# EAGLE design CIA-11:19:21 (EAGLE 9.7.0)
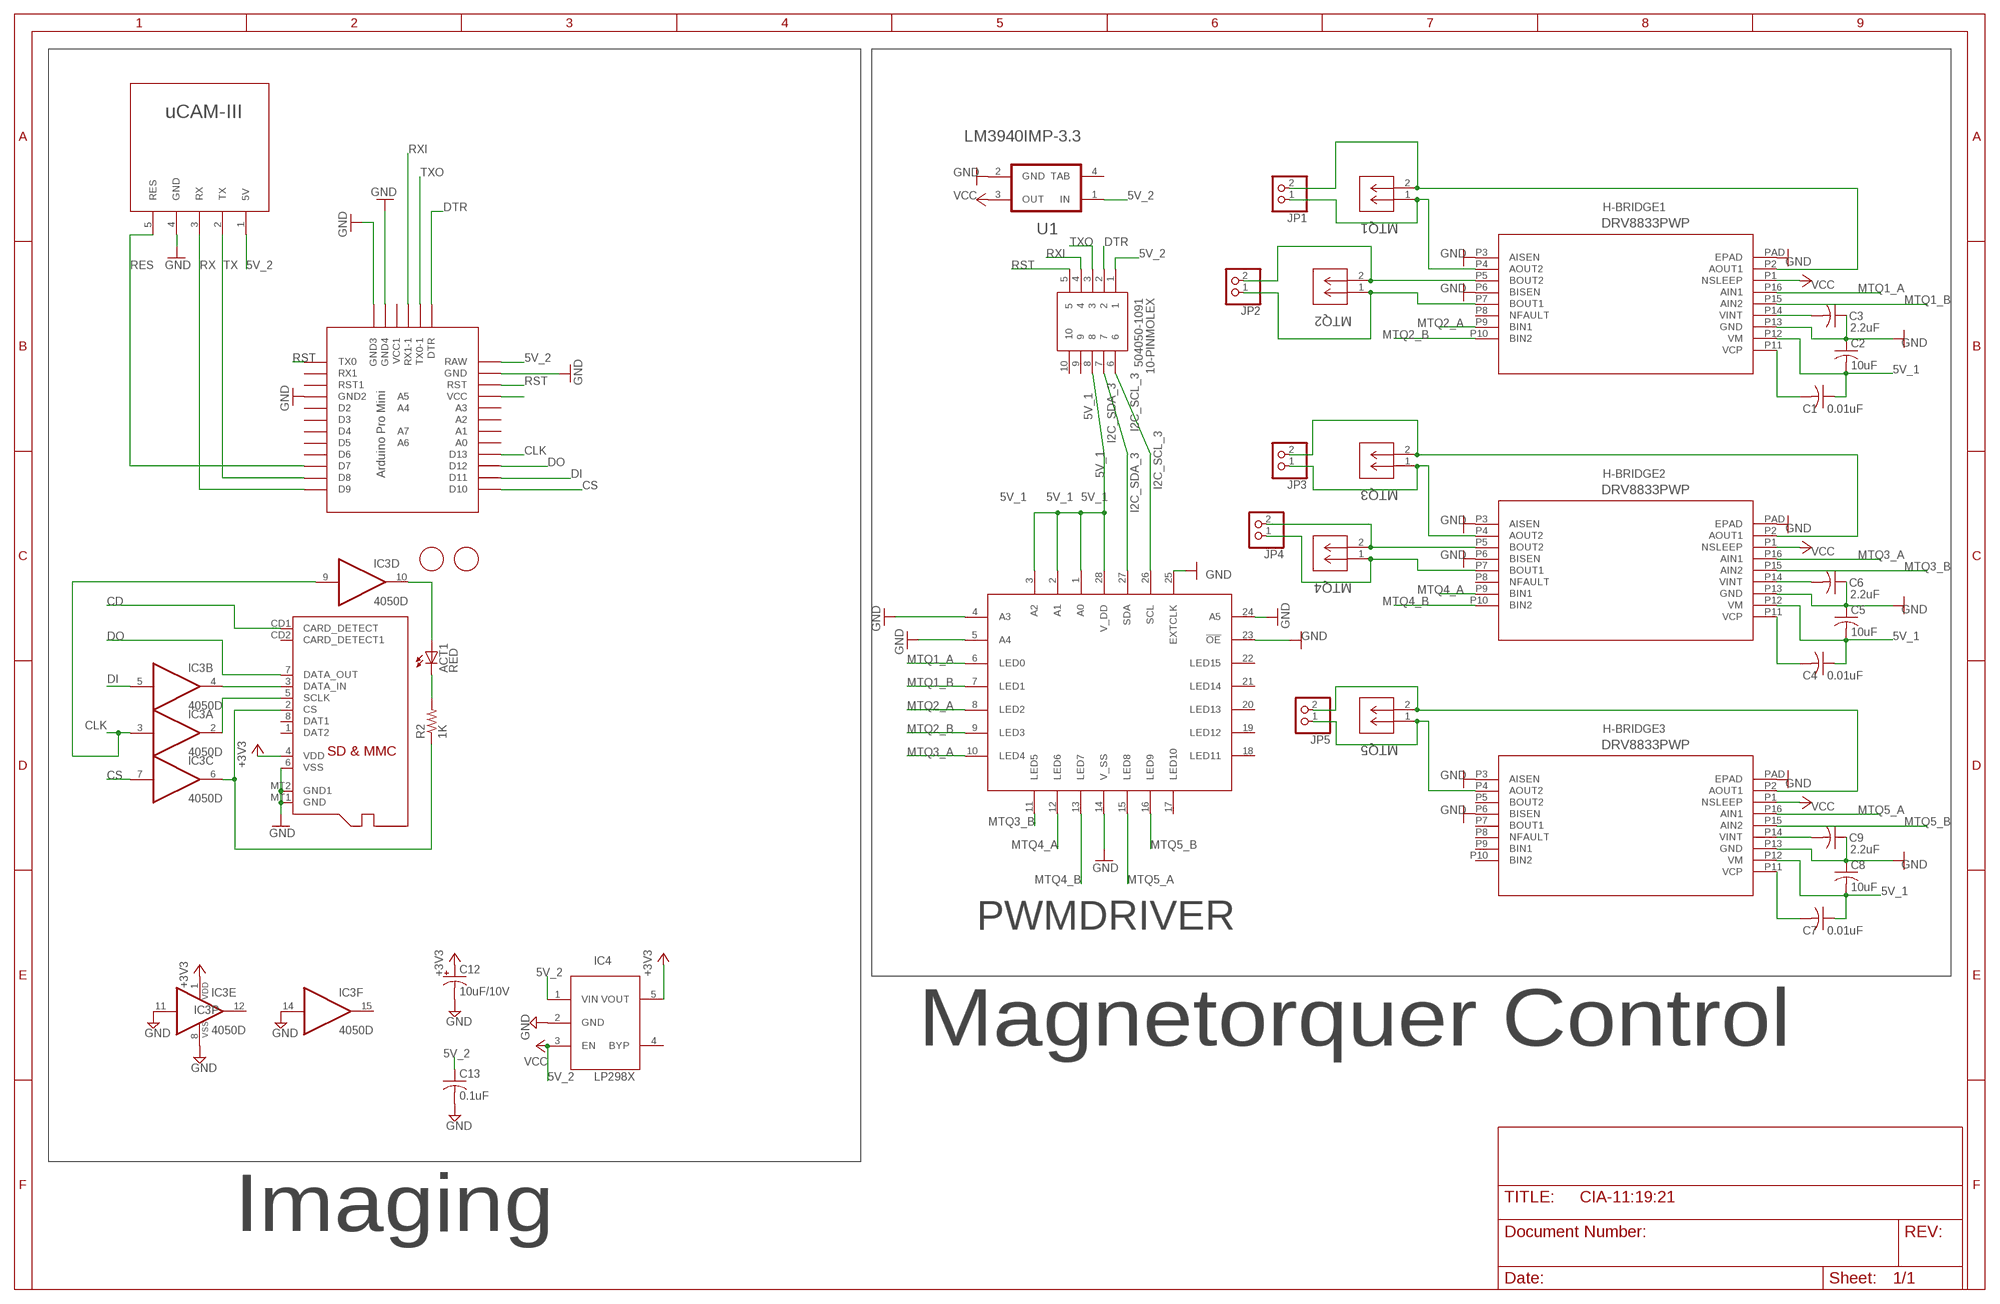
[diagram p0: schematic, sheet 1, part 1 of 2]
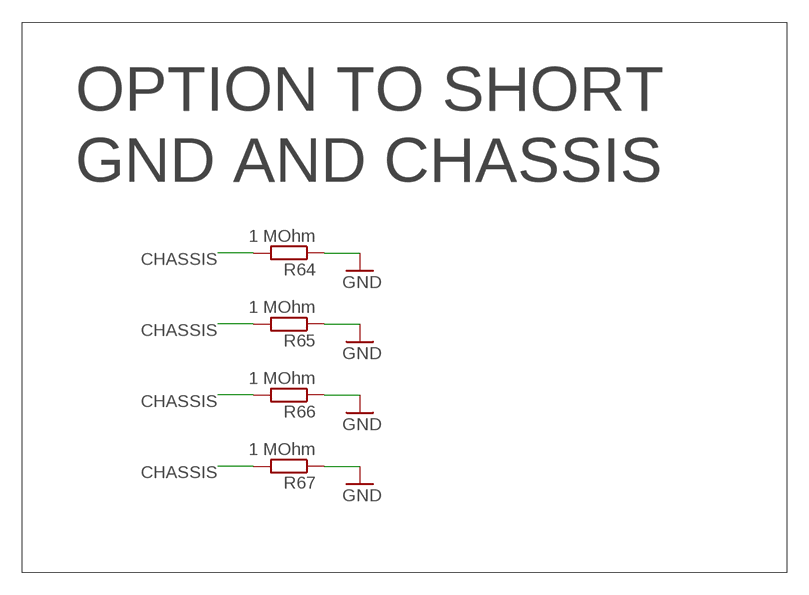
[diagram p1: schematic, sheet 1, part 2 of 2]

## Parts
10-PINMOLEX  504050-1091  [504050-1091]
ACT1  RED  LEDCHIP-LED0805  [CHIP-LED0805]
C1  0.01uF  C-USC0603K  [C0603K]
C2  10uF  C-USC1210K  [C1210K]
C3  2.2uF  C-USC0603K  [C0603K]
C4  0.01uF  C-USC0603K  [C0603K]
C5  10uF  C-USC1210K  [C1210K]
C6  2.2uF  C-USC0603K  [C0603K]
C7  0.01uF  C-USC0603K  [C0603K]
C8  10uF  C-USC1210K  [C1210K]
C9  2.2uF  C-USC0603K  [C0603K]
C12  10uF/10V  CPOL-USA/3216-18R  [A/3216-18R]
C13  0.1uF  C-USC0805K  [C0805K]
H-BRIDGE1  DRV8833PWP  [HTSSOP16]
H-BRIDGE2  DRV8833PWP  [HTSSOP16]
H-BRIDGE3  DRV8833PWP  [HTSSOP16]
IC3  4050D  [SO16]
IC4  LP298XS  [SOT23-5L]
JP1  PINHD-1X2  [1X02]
JP2  PINHD-1X2  [1X02]
JP3  PINHD-1X2  [1X02]
JP4  PINHD-1X2  [1X02]
JP5  PINHD-1X2  [1X02]
MTQ1  DF13C-2P-1.25V(51)  [CON2_1X2_U_DF13]
MTQ2  DF13C-2P-1.25V(51)  [CON2_1X2_U_DF13]
MTQ3  DF13C-2P-1.25V(51)  [CON2_1X2_U_DF13]
MTQ4  DF13C-2P-1.25V(51)  [CON2_1X2_U_DF13]
MTQ5  DF13C-2P-1.25V(51)  [CON2_1X2_U_DF13]
PWMDRIVER  PCA9685PW  [TSSOP28]
R2  1K  R-US_R0805  [R0805]
R64  1 MOhm  R-EU_R0805  [R0805]
R65  1 MOhm  R-EU_R0805  [R0805]
R66  1 MOhm  R-EU_R0805  [R0805]
R67  1 MOhm  R-EU_R0805  [R0805]
U1  TI_NATIONAL_SEMICONDUCTOR_LM3940IMP-3.3TI_NATIONAL_SEMICONDUCTOR_LM3940IMP-3.3_0_1  [TI_NATIONAL_SEMICONDUCTOR_LM3940IMP-3.3_1]
U$2  UCAM-III  [UCAM-III]
U$6  FIDUCIAL  [FIDUCIAL_1MM]
U$7  FIDUCIAL  [FIDUCIAL_1MM]
U$8  PRO-MINI-2  [PRO-MINI-2]
X2  MICROSD  [MICROSD]

## Nets
5V_1 [New Class]: 10-PINMOLEX.8 C1.1 C2.2 C4.1 C5.2 C7.1 C8.2 H-BRIDGE1.P12(VM) H-BRIDGE2.P12(VM) H-BRIDGE3.P12(VM) PWMDRIVER.1(A0) PWMDRIVER.2(A1) PWMDRIVER.3(A2) PWMDRIVER.28(V_DD)
5V_2 [New Class]: 10-PINMOLEX.1 C13.1 IC4.1(VIN) IC4.3(EN) U1.1(IN) U$2.1(5V) U$8.RAW ; supply symbol labelled VCC
+3V3: C12.+ IC3.1(P:VDD) IC4.5(VOUT) X2.4(VDD)
CD: X2.CD1(CARD_DETECT)
CHASSIS: R64.2 R65.2 R66.2 R67.2
CLK: IC3.3(A:I) IC3.9(D:I) U$8.D13
CS: IC3.7(C:I) U$8.D10
DI: IC3.5(B:I) U$8.D11
DO: U$8.D12 X2.7(DATA_OUT)
DTR [MTQs]: 10-PINMOLEX.2 U$8.DTR
GND [MTQs]: C2.1 C3.1 C5.1 C6.1 C8.1 C9.1 C12.- C13.2 H-BRIDGE1.P3(AISEN) H-BRIDGE1.P6(BISEN) H-BRIDGE1.P13(GND) H-BRIDGE1.PAD(EPAD) H-BRIDGE2.P3(AISEN) H-BRIDGE2.P6(BISEN) H-BRIDGE2.P13(GND) H-BRIDGE2.PAD(EPAD) H-BRIDGE3.P3(AISEN) H-BRIDGE3.P6(BISEN) H-BRIDGE3.P13(GND) H-BRIDGE3.PAD(EPAD) IC3.8(P:VSS) IC3.11(E:I) IC3.14(F:I) IC4.2(GND) PWMDRIVER.4(A3) PWMDRIVER.5(A4) PWMDRIVER.14(V_SS) PWMDRIVER.23(!OE) PWMDRIVER.24(A5) PWMDRIVER.25(EXTCLK) R64.1 R65.1 R66.1 R67.1 U1.2(GND) U$8.GND U$8.GND1(GND2) U$8.GND2(GND3) U$8.GND3(GND4) X2.6(VSS) X2.MT1(GND) X2.MT2(GND1)
I2C_SCL_3: 10-PINMOLEX.6 PWMDRIVER.26(SCL)
I2C_SDA_3: 10-PINMOLEX.7 PWMDRIVER.27(SDA)
MTQ1_A: H-BRIDGE1.P16(AIN1) PWMDRIVER.6(LED0)
MTQ1_B: H-BRIDGE1.P15(AIN2) PWMDRIVER.7(LED1)
MTQ2_A: H-BRIDGE1.P9(BIN1) PWMDRIVER.8(LED2)
MTQ2_B: H-BRIDGE1.P10(BIN2) PWMDRIVER.9(LED3)
MTQ3_A: H-BRIDGE2.P16(AIN1) PWMDRIVER.10(LED4)
MTQ3_B: H-BRIDGE2.P15(AIN2) PWMDRIVER.11(LED5)
MTQ4_A: H-BRIDGE2.P9(BIN1) PWMDRIVER.12(LED6)
MTQ4_B: H-BRIDGE2.P10(BIN2) PWMDRIVER.13(LED7)
MTQ5_A: H-BRIDGE3.P16(AIN1) PWMDRIVER.15(LED8)
MTQ5_B: H-BRIDGE3.P15(AIN2) PWMDRIVER.16(LED9)
N$1 [MTQs]: H-BRIDGE2.P2(AOUT1) JP3.2 MTQ3.2
N$2: C3.2 H-BRIDGE1.P14(VINT)
N$3 [MTQs]: H-BRIDGE1.P4(AOUT2) JP1.1 MTQ1.1
N$4 [MTQs]: H-BRIDGE1.P2(AOUT1) JP1.2 MTQ1.2
N$5 [MTQs]: H-BRIDGE1.P7(BOUT1) JP2.1 MTQ2.1
N$6 [MTQs]: H-BRIDGE1.P5(BOUT2) JP2.2 MTQ2.2
N$7: C1.2 H-BRIDGE1.P11(VCP)
N$8 [MTQs]: H-BRIDGE2.P7(BOUT1) JP4.1 MTQ4.1
N$9 [MTQs]: H-BRIDGE2.P5(BOUT2) JP4.2 MTQ4.2
N$10: C6.2 H-BRIDGE2.P14(VINT)
N$11: C4.2 H-BRIDGE2.P11(VCP)
N$12 [MTQs]: H-BRIDGE2.P4(AOUT2) JP3.1 MTQ3.1
N$13 [MTQs]: H-BRIDGE3.P2(AOUT1) JP5.2 MTQ5.2
N$14 [MTQs]: U$2.4(GND) ; supply symbol labelled GND
N$15: U$8.TX0
N$16: C9.2 H-BRIDGE3.P14(VINT)
N$17: C7.2 H-BRIDGE3.P11(VCP)
N$18 [MTQs]: H-BRIDGE3.P4(AOUT2) JP5.1 MTQ5.1
N$21: U$8.VCC
N$22: ACT1.A IC3.10(D:O)
N$23: IC3.2(A:O) X2.5(SCLK)
N$24: IC3.6(C:O) R2.1 X2.2(CS)
N$25: ACT1.C R2.2
N$26: IC3.4(B:O) X2.3(DATA_IN)
RES: U$2.5(RES) U$8.D7
RST: 10-PINMOLEX.5 U$8.RST
RX: U$2.3(RX) U$8.D9
RXI: 10-PINMOLEX.4 U$8.RX1-1
TX: U$2.2(TX) U$8.D8
TXO: 10-PINMOLEX.3 U$8.TX0-1
VCC: H-BRIDGE1.P1(NSLEEP) H-BRIDGE2.P1(NSLEEP) H-BRIDGE3.P1(NSLEEP) U1.3(OUT)
Unconnected: 10-PINMOLEX.9 10-PINMOLEX.10 H-BRIDGE1.P8(NFAULT) H-BRIDGE2.P8(NFAULT) H-BRIDGE3.P5(BOUT2) H-BRIDGE3.P7(BOUT1) H-BRIDGE3.P8(NFAULT) H-BRIDGE3.P9(BIN1) H-BRIDGE3.P10(BIN2) IC3.12(E:O) IC3.15(F:O) IC4.4(BYP) PWMDRIVER.17(LED10) PWMDRIVER.18(LED11) PWMDRIVER.19(LED12) PWMDRIVER.20(LED13) PWMDRIVER.21(LED14) PWMDRIVER.22(LED15) U$8.A0 U$8.A1 U$8.A2 U$8.A3 U$8.A4 U$8.A5 U$8.A6 U$8.A7 U$8.D2 U$8.D3 U$8.D4 U$8.D5 U$8.D6 U$8.RST1 U$8.RX1 U$8.VCC1 X2.1(DAT2) X2.8(DAT1) X2.CD2(CARD_DETECT1)

## Notes on the sheet
- OPTION TO SHORT
- GND AND CHASSIS
- Magnetorquer Control
- Imaging

## Power pins joined to a net without a drawn wire
TAB: U1.4(TAB)

## Library data of the parts
10-PINMOLEX = molex_10pin:504050-1091: Pico-Lock SMT Wire-to-Board Header 10way Molex 504050 Series, 1.5mm Pitch 10 Way 1 Row Right Angle PCB Header, SMT Termination, 3A Source: Datasheet <https://componentsearchengine.com/Datasheets/1/504050-1091.pdf>; DESCRIPTION: Pico-Lock SMT Wire-to-Board Header 10way Molex 504050 Series, 1.5mm Pitch 10 Way 1 Row Right Angle PCB Header, SMT Termination, 3A; HEIGHT: mm; MANUFACTURER_NAME: Molex; MANUFACTURER_PART_NUMBER: 504050-1091; MOUSER_PART_NUMBER: 538-504050-1091; MOUSER_PRICE-STOCK: https://www.mouser.com/Search/Refine.aspx?Keyword=538-504050-1091; OC_NEWARK: unknown
ACT1 = adafruit:LED: LED OSRAM: - CHIPLED LG R971, LG N971, LY N971, LG Q971, LY Q971, LO R971, LY R971 LH N974, LH R974 LS Q976, LO Q976, LY Q976 LO Q996 - Hyper CHIPLED LW Q18S LB Q993, LB Q99A, LB R99A - SideLED LS A670, LO A670, LY A670, LG A670, LP A670 LB A673, LV A673, LT A673, LW A673 LH A674 LY A675 LS A676, LA A676, LO A676, LY A676, LW A676 LS A679, LY A679, LG A679 - Hyper Micro SIDELED® LS Y876, LA Y876, LO Y876, LY Y876 LT Y87S - SmartLED LW L88C, LW L88S LB L89C, LB L89S, LG L890 LS L89K, LO L89K, LY L89K LS L896, LA L896, LO L896, LY L896 - TOPLED LS T670, LO T670, LY T670, LG T670, LP T670 LSG T670, LSP T670, LSY T670, LOP T670, LYG T670 LG T671, LOG T671, LSG T671 LB T673, LV T673, LT T673, LW T673 LH T674 LS T676, LA T676, LO T676, LY T676, LB T676, LH T676, LSB T676, LW T676 LB T67C, LV T67C, LT T67C, LS T67K, LO T67K, LY T67K, LW E67C LS E67B, LA E67B, LO E67B, LY E67B, LB E67C, LV E67C, LT E67C LW T67C LS T679, LY T679, LG T679 LS T770, LO T770, LY T770, LG T770, LP T770 LB T773, LV T773, LT T773, LW T773 LH T774 LS E675, LA E675, LY E675, LS T675 LS T776, LA T776, LO T776, LY T776, LB T776 LHGB T686 LT T68C, LB T68C - Hyper Mini TOPLED® LB M676 - Mini TOPLED Santana® LG M470 LS M47K, LO M47K, LY M47K Source: http://www.osram.convergy.de/; OC_NEWARK: unknown
C1-C9 = rcl:C-US: CAPACITOR, American symbol; OC_NEWARK: unknown; SPICEPREFIX: C
C12 = adafruit:CPOL-US: POLARIZED CAPACITOR, American symbol; OC_NEWARK: unknown
C13 = adafruit:C-US: CAPACITOR, American symbol; OC_NEWARK: unknown
H-BRIDGE1-H-BRIDGE3 = myparts:DRV8833PWP; OC_NEWARK: unknown
IC3 = 40xx:4050: Hex non-inverting BUFFER; OC_NEWARK: unknown
IC4 = adafruit:LP298X; OC_NEWARK: unknown
JP1-JP5 = pinhead:PINHD-1X2: PIN HEADER; MF: MOLEX; MPN: 22-11-2022; OC_NEWARK: 55H9825
MTQ1-MTQ5 = myparts:DF13C-2P-1.25V(51); BUILT_BY: EMA_UL_Team; MANUFACTURER_PART_NUMBER: DF13C-2P-1.25V(51); OC_NEWARK: unknown; VENDOR: Hirose
PWMDRIVER = myparts:PCA9685PW; OC_NEWARK: unknown
R2 = adafruit:R-US_: RESISTOR, American symbol; OC_NEWARK: unknown
R64-R67 = rcl:R-EU_: RESISTOR, European symbol; SPICEPREFIX: R
U1 = TI National Semiconductor - LM3940IMP-3.3:TI_NATIONAL_SEMICONDUCTOR_LM3940IMP-3.3: PM-REG-LM2940-TO4; CIIVA_IDS: 1170636; CODE__IPC: SOT223-4; CODE__JEDEC: TO-261-AA; COMPONENT_LINK_1_DESCRIPTION: Datasheet URL; COMPONENT_LINK_1_URL: http://www.ti.com/general/docs/lit/getliterature.tsp?genericPartNumber=LM3940&fileType=pdf; COMP_TYPE: LDO IC; FOOTPRINT_VARIANT_NAME_0: Level C; FOOTPRINT_VARIANT_NAME_1: Level B; FOOTPRINT_VARIANT_NAME_2: Level A; IMPORTED: yes; IMPORTED_FROM: vault; IMPORT_TS: 1521848719; MF: TI National Semiconductor; MPN: LM3940IMP-3.3; PACKAGE: DCY0004A; PACKAGE_DESCRIPTION: Molded SOT-223, 6.50 x 3.56 x 1.6mm Body, 4 Lead, 2.3mm Pitch; PACKAGE_TOP_MARKING: XYTT*L52B; PIN_COUNT: 4; POWER_WISE: N; PREFIX: U; RELEASE_DATE: 1464091660; ROHS: No; VAULT_GUID: 7D174BE9-4519-4BE6-B3E4-802F171613CA; VAULT_REVISION: 33897558-4D8B-46BE-97DA-B950EC492A4C
U$2 = myparts:UCAM-III; OC_NEWARK: unknown
U$6 U$7 = adafruit:FIDUCIAL: For use by pick and place machines to calibrate the vision/machine, 1mm By microbuilder.eu; OC_NEWARK: unknown
U$8 = myparts:PRO-MINI-2: Arduino Pro Mini Layout 2 Sparkfun.com; OC_NEWARK: unknown
X2 = adafruit:MICROSD: Micro-SD / Transflash card holder with SPI pinout For the 3M # 2908-05WB-MG and/or 4UCON #19656 push-push type; OC_NEWARK: unknown

## Net classes
1 New Class: width 0.457 mm
2 MTQs: width 0.305 mm

## Board
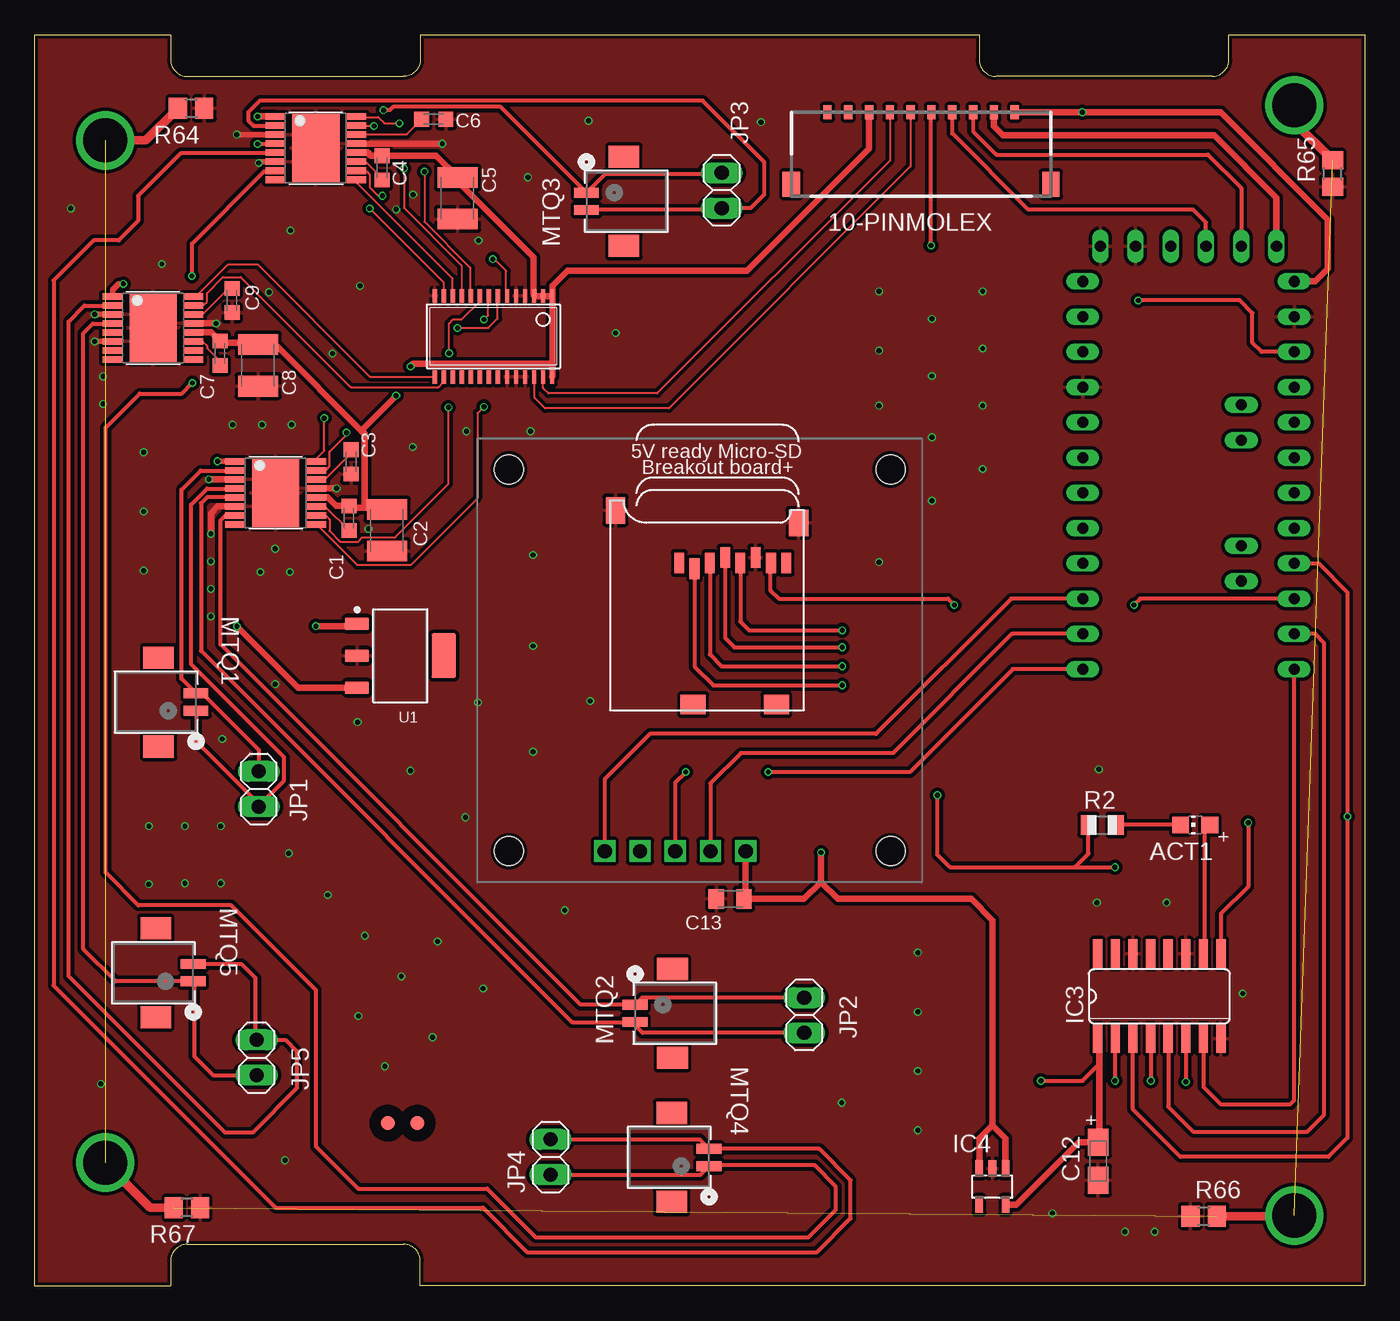
[diagram p2: board, top side]
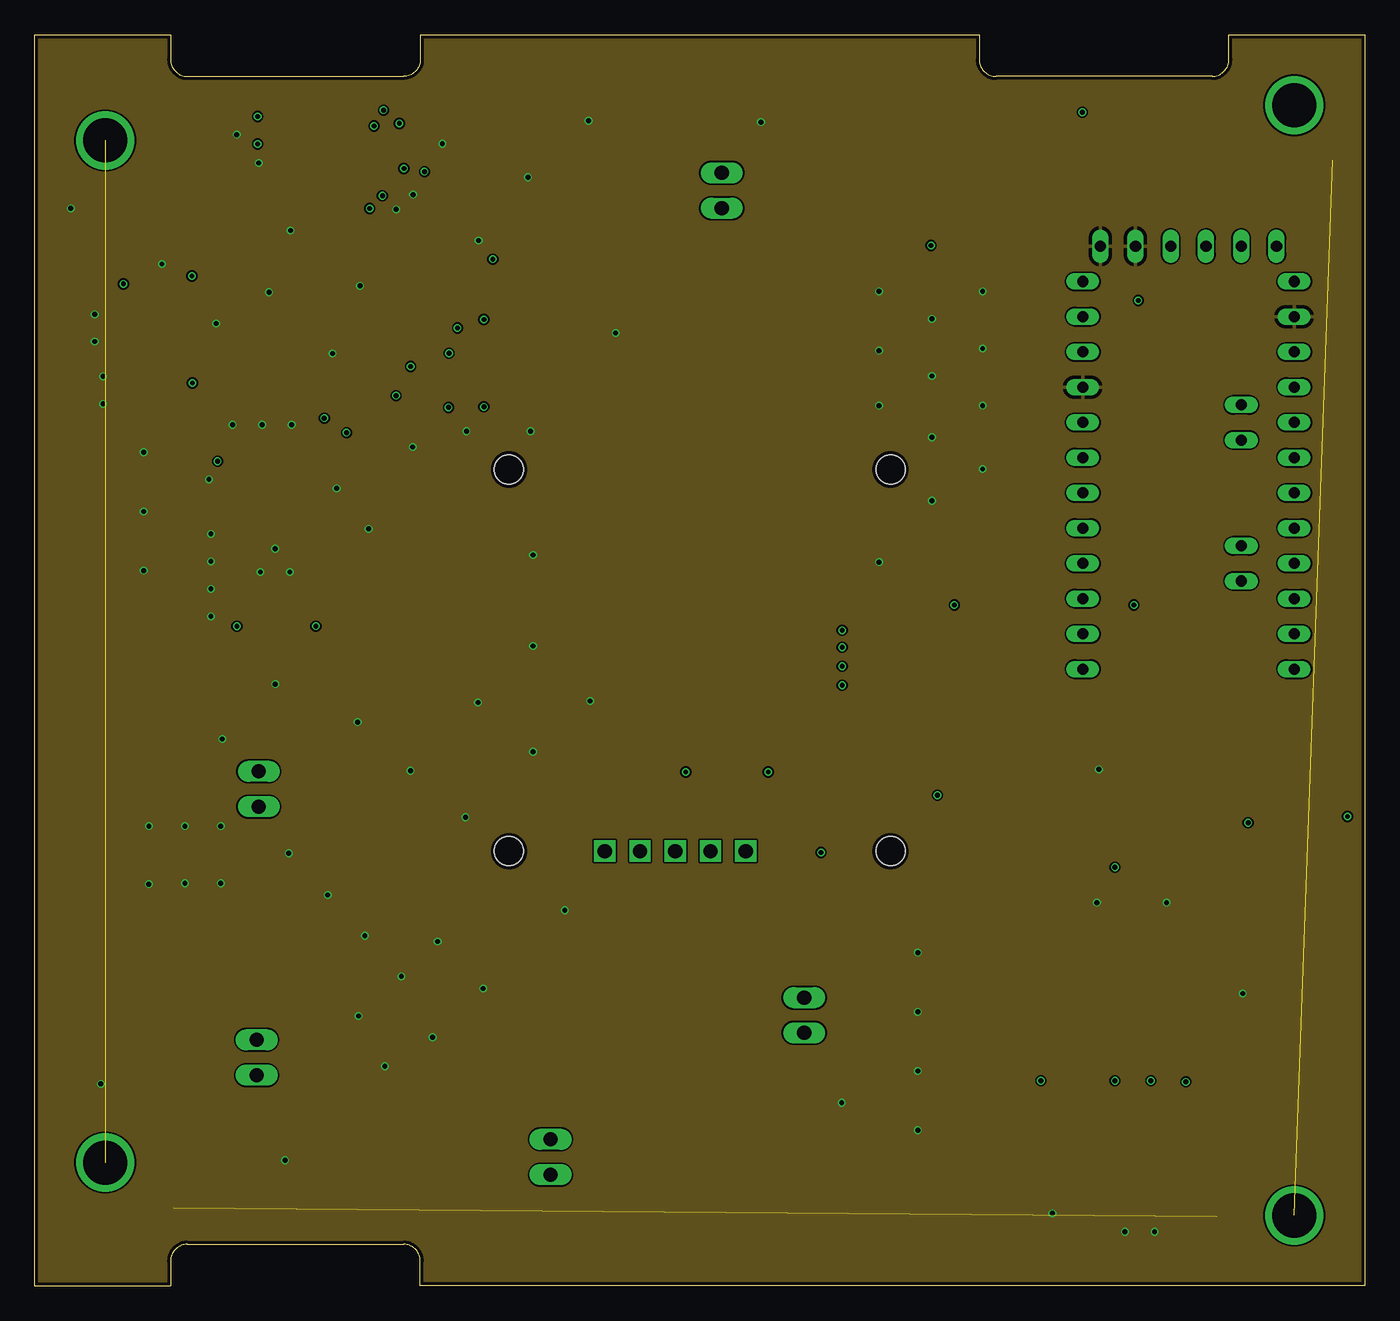
[diagram p3: board, inner layer Route2]
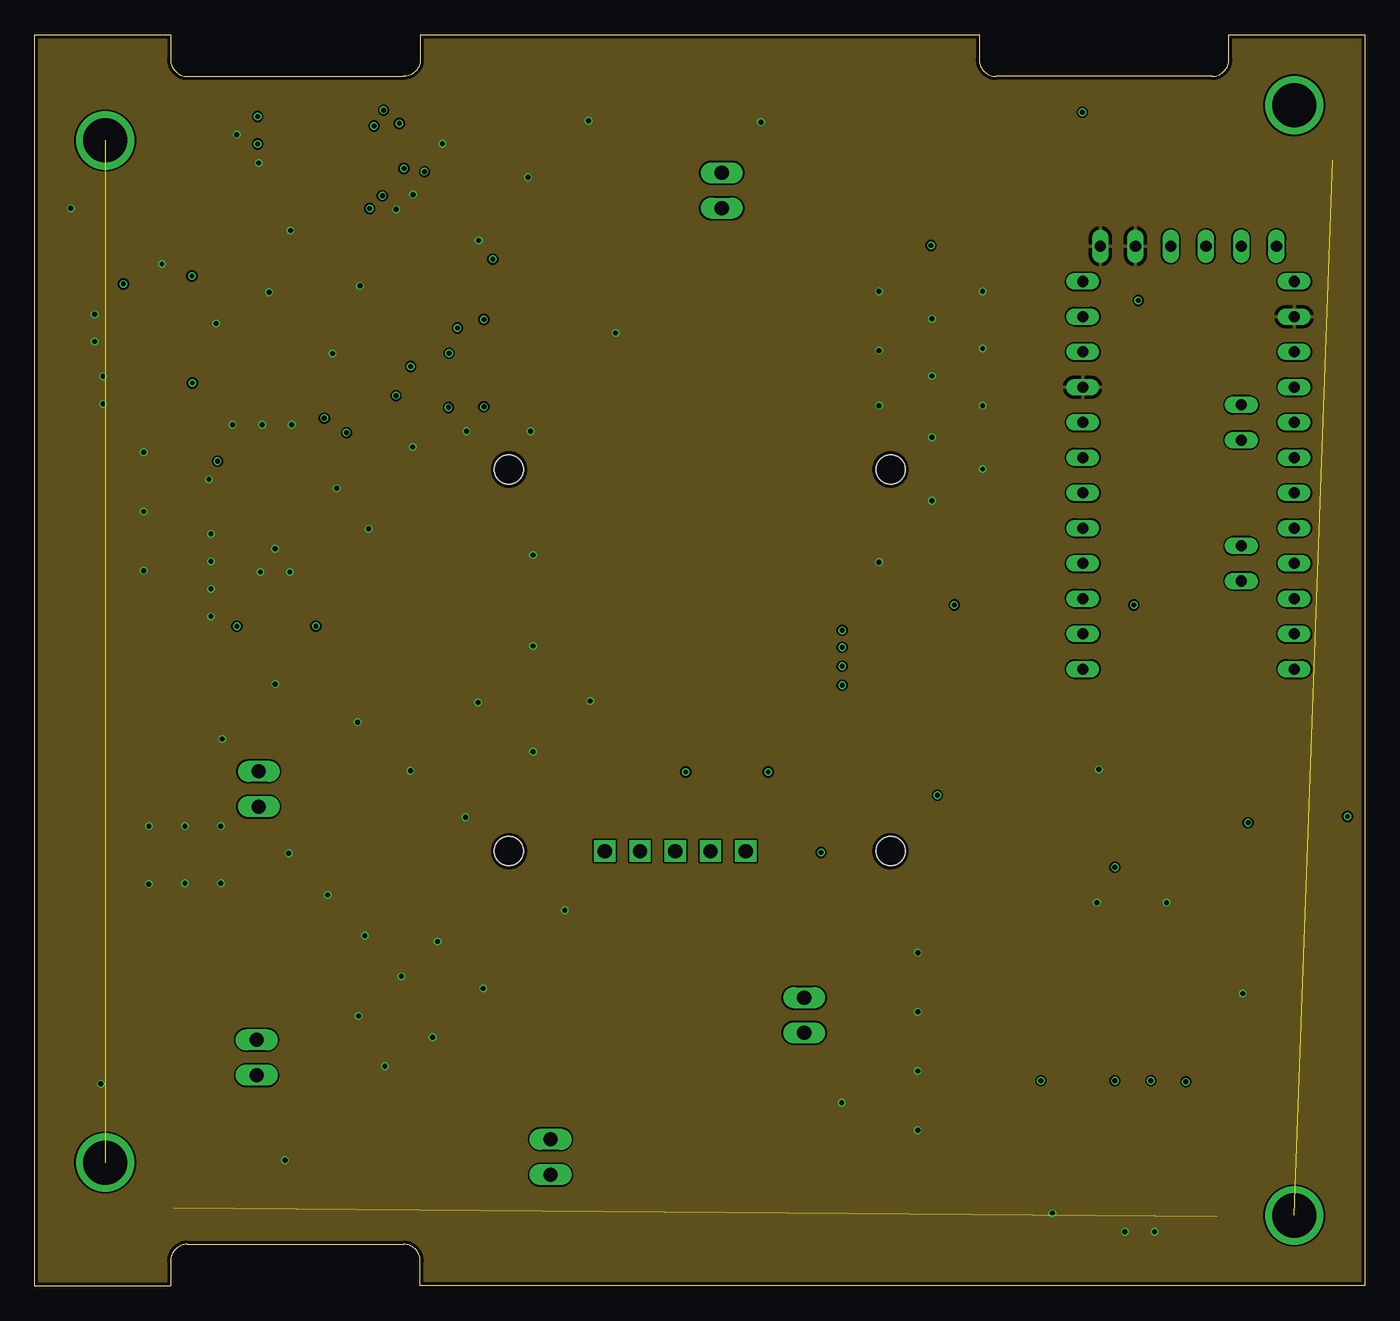
[diagram p4: board, inner layer Route15]
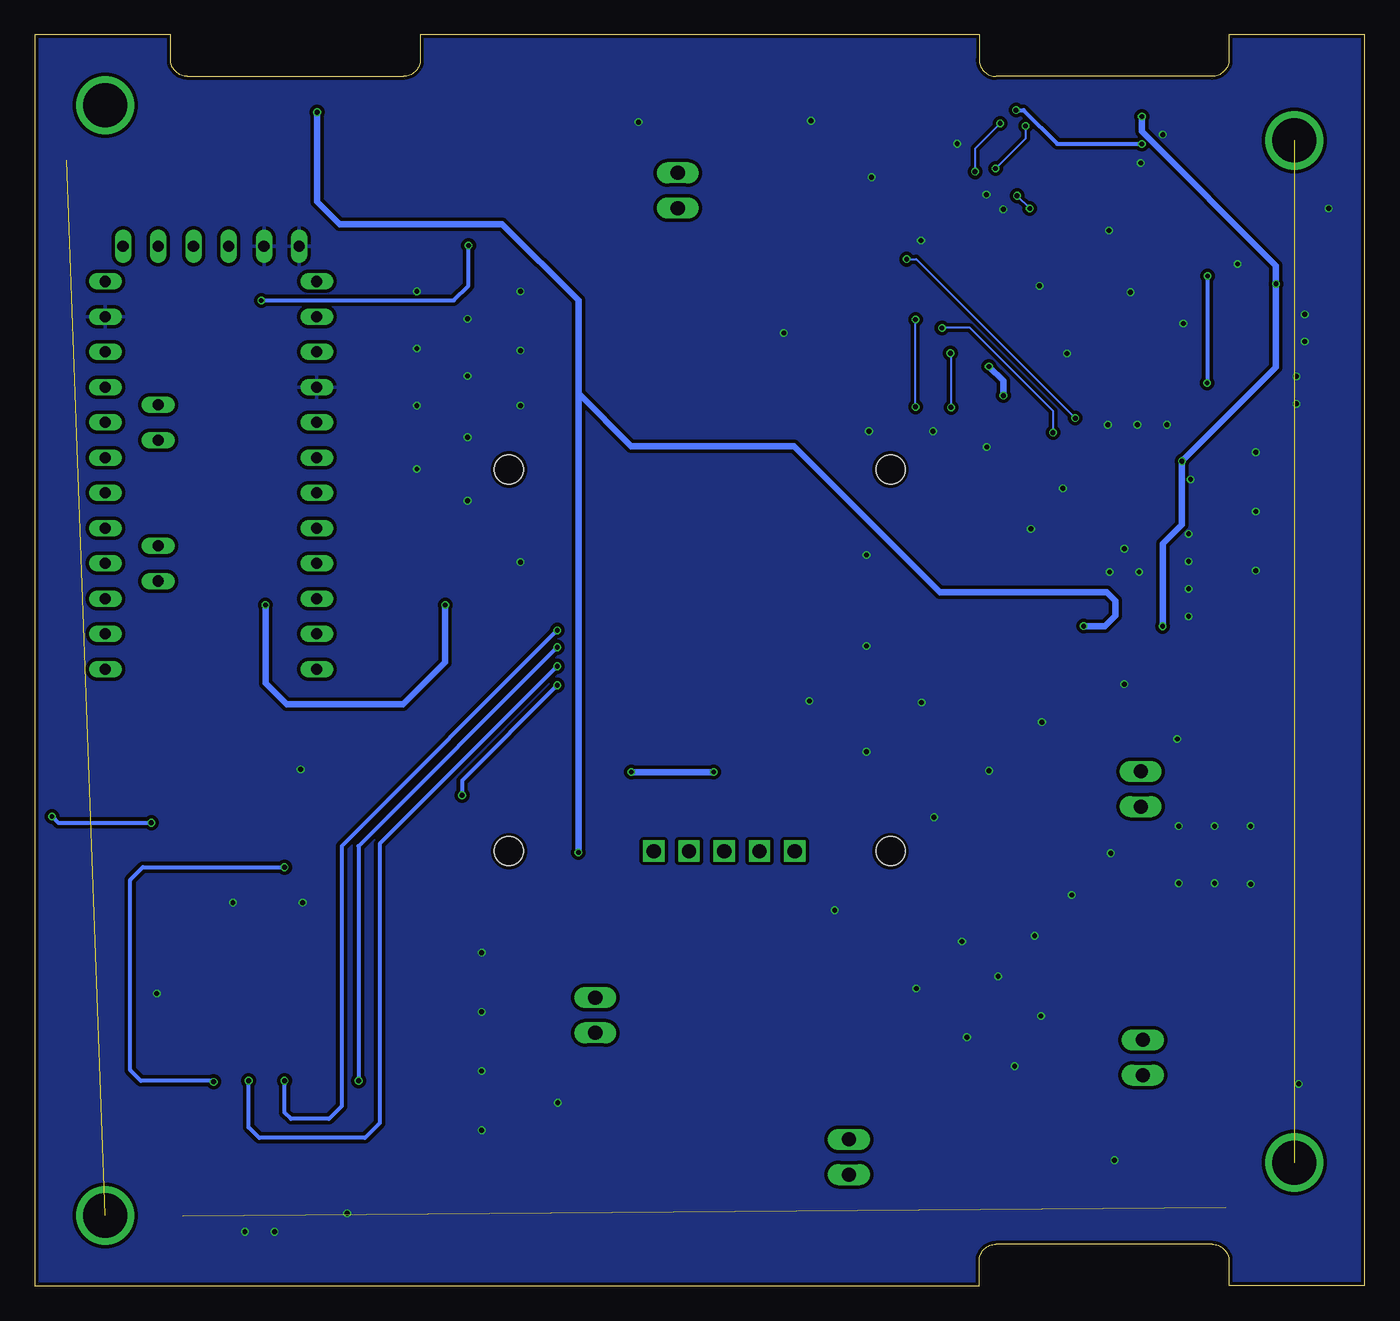
[diagram p5: board, bottom side, seen from below]

Size 95.89 x 90.17 mm. Coordinates in mm from the lower left corner, seen from the top.
Outline: 27.8,0 27.8,1.8 arc90 26.6,3 11,3 arc90 9.8,1.8 9.8,0 0,0 0,90.17 9.8,90.17 9.8,88.37 arc90 11,87.17 26.6,87.17 arc90 27.8,88.37 27.8,90.17 68.09,90.17 68.09,88.37 arc90 69.29,87.17 84.89,87.17 arc90 86.09,88.37 86.09,90.17 95.89,90.17 95.89,0 27.8,0
Copper layers (1*2*15*16): Top 0.035mm / dielectric 0.23mm / Route2 0.035mm / dielectric 0.93mm / Route15 0.035mm / dielectric 0.23mm / Bottom 0.035mm
Design rules "MF_Standard_4_Layer": minimum track width 5mil, minimum drill 10mil, track to track 5mil, track to pad 5mil, pad to pad 5mil, via to via 5mil, smd to smd 0mil, copper to edge 10mil, drill to drill 10mil, minimum pad ring 4mil, minimum via ring 4mil, stop-mask expansion 2mil, vias tented up to drill 25mil, thermal gap 10mil

### Footprints (pad centres in the part's own frame; a part is rotated, then mirrored left to right if it is on the bottom)
504050-1091 = smd 0.6 x 1: 1 -13.5,0; 2 -12,0; 3 -10.5,0; 4 -9,0; 5 -7.5,0; 6 -6,0; 7 -4.5,0; 8 -3,0; 9 -1.5,0; 10 0,0 | smd 1.25 x 1.8: 11 2.605,5.19; 12 -16.105,5.19
CHIP-LED0805 = smd 1.2 x 1.2: A 0,-1.05; C 0,1.05
C0603K = smd 1.05 x 1.08: 1 -0.875,0; 2 0.875,0
C1210K = smd 1.5 x 2.9: 1 -1.5,0; 2 1.5,0
A/3216-18R = smd 1.95 x 1.5: + 1.375,0; - -1.375,0
C0805K = smd 1.1 x 1.4: 1 -1,0; 2 1,0
HTSSOP16 = smd 1.5 x 0.45: P1 -2.9,2.275; P2 -2.9,1.625; P3 -2.9,0.975; P4 -2.9,0.325; P5 -2.9,-0.325; P6 -2.9,-0.975; P7 -2.9,-1.625; P8 -2.9,-2.275; P9 2.9,-2.275; P10 2.9,-1.625; P11 2.9,-0.975; P12 2.9,-0.325; P13 2.9,0.325; P14 2.9,0.975; P15 2.9,1.625; P16 2.9,2.275 | smd 3.4 x 5: PAD 0,0
SO16 = smd 0.66 x 2.032: 1 -4.445,-3.073; 2 -3.175,-3.073; 3 -1.905,-3.073; 4 -0.635,-3.073; 5 0.635,-3.073; 6 1.905,-3.073; 7 3.175,-3.073; 8 4.445,-3.073; 9 4.445,3.073; 10 3.175,3.073; 11 1.905,3.073; 12 0.635,3.073; 13 -0.635,3.073; 14 -1.905,3.073; 15 -3.175,3.073; 16 -4.445,3.073
SOT23-5L = smd 0.55 x 1.2: 1 -0.95,-1.3; 2 0,-1.3; 3 0.95,-1.3; 4 0.95,1.3; 5 -0.95,1.3
1X02 = drill 1.016 long: 1 -1.27,0; 2 1.27,0
CON2_1X2_U_DF13 = smd 0.711 x 1.778: 1 0,0; 2 -1.25,0 | smd 1.6 x 2.21: 3 -3.825,-2.7; 5 2.575,-2.7
TSSOP28 = smd 0.305 x 0.991: 1 -4.225,-2.918; 2 -3.575,-2.918; 3 -2.925,-2.918; 4 -2.275,-2.918; 5 -1.625,-2.918; 6 -0.975,-2.918; 7 -0.325,-2.918; 8 0.325,-2.918; 9 0.975,-2.918; 10 1.625,-2.918; 11 2.275,-2.918; 12 2.925,-2.918; 13 3.575,-2.918; 14 4.225,-2.918; 15 4.225,2.918; 16 3.575,2.918; 17 2.925,2.918; 18 2.275,2.918; 19 1.625,2.918; 20 0.975,2.918; 21 0.325,2.918; 22 -0.325,2.918; 23 -0.975,2.918; 24 -1.625,2.918; 25 -2.275,2.918; 26 -2.925,2.918; 27 -3.575,2.918; 28 -4.225,2.918
R0805 = smd 1.1 x 1.4: 1 -1,0; 2 1,0
R0805' = smd 1.3 x 1.5: 1 -0.95,0; 2 0.95,0
TI_NATIONAL_SEMICONDUCTOR_LM3940IMP-3.3_1 = smd 1.75 x 0.9: 1 -3.125,2.3; 2 -3.125,0; 3 -3.125,-2.3 | smd 1.75 x 3.2: 4 3.125,0
UCAM-III = drill 1.02 square: 1 19.31,2.25; 2 16.77,2.25; 3 14.23,2.25; 4 11.69,2.25; 5 9.15,2.25 | hole 2.1: 2.25,2.25; 29.75,2.25; 29.75,29.75; 2.25,29.75
FIDUCIAL_1MM = smd 1 x 1: 1 0,0
PRO-MINI-2 = drill 0.8 long: A0 6.35,2.54; A1 6.35,0; A2 6.35,-2.54; A3 6.35,-5.08; A4 2.54,1.27; A5 2.54,3.81; A6 2.54,-8.89; A7 2.54,-6.35; D2 -8.89,2.54; D3 -8.89,0; D4 -8.89,-2.54; D5 -8.89,-5.08; D6 -8.89,-7.62; D7 -8.89,-10.16; D8 -8.89,-12.7; D9 -8.89,-15.24; D10 6.35,-15.24; D11 6.35,-12.7; D12 6.35,-10.16; D13 6.35,-7.62; DTR 5.08,15.24; GND 6.35,10.16; GND1 -8.89,5.08; GND2 -7.62,15.24; GND3 -5.08,15.24; RAW 6.35,12.7; RST 6.35,7.62; RST1 -8.89,7.62; RX1 -8.89,10.16; RX1-1 0,15.24; TX0 -8.89,12.7; TX0-1 2.54,15.24; VCC 6.35,5.08; VCC1 -2.54,15.24
MICROSD = smd 0.7 x 1.5: 1 9,-10.64; 2 7.9,-10.24; 3 6.8,-10.64; 4 5.7,-11.04; 5 4.6,-10.64; 6 3.5,-11.04; 7 2.4,-10.64; 8 1.3,-10.64 | smd 1.8 x 1.4: CD1 2,-0.44; CD2 8,-0.44 | smd 1.4 x 1.9: MT1 0.4,-13.54; MT2 13.6,-14.44

### Placement (x,y rotation side)
10-PINMOLEX  57.15,84.58 180 top
ACT1  83.67,33.22 90 top
C1  22.66,55.32 270 top
C2  25.4,54.46 90 top
C3  22.81,59.39 90 top
C4  25.04,80.57 270 top
C5  30.48,78.38 90 top
C6  28.77,84.07 180 top
C7  13.36,67.21 270 top
C8  16.1,66.34 90 top
C9  14.22,71.02 90 top
C12  76.66,8.99 90 top
C13  50.14,27.89 180 top
H-BRIDGE1  17.37,57.15 0 top
H-BRIDGE2  20.27,81.99 0 top
H-BRIDGE3  8.53,69.04 0 top
IC3  81.08,20.88 0 top
IC4  69.04,7.16 180 top
JP1  16.15,35.81 90 top
JP2  55.47,19.51 270 top
JP3  49.53,78.94 270 top
JP4  37.19,9.3 90 top
JP5  16,16.46 90 top
MTQ1  11.63,41.45 270 top
MTQ2  43.28,20.27 90 top
MTQ3  39.78,78.79 90 top
MTQ4  48.62,8.64 270 top
MTQ5  11.43,21.95 270 top
PWMDRIVER  33.07,68.43 180 top
R2  76.96,33.22 0 top
R64  1 MOhm  [R0805']  11.28,84.86 180 top
R65  1 MOhm  [R0805']  93.57,80.16 90 top
R66  1 MOhm  [R0805']  84.28,5.03 0 top
R67  1 MOhm  [R0805']  10.97,5.64 180 top
U1  26.37,45.42 0 top
U$2  31.95,29.09 0 top
U$6  25.45,11.73 0 top
U$7  27.58,11.73 0 top
U$8  84.44,59.69 0 top
X2  55.47,41.45 180 top

### Tracks (layer width: path | path; a pad name or v marks a point on that pad's centre or on a via)
5V_1  (via drill 0.35)
  Top 0.457: H-BRIDGE1.P12 20.34,56.84 21.11,56.84 21.72,56.24 22.63,56.24 C1.1 22.86,56.08 23.77,56.08 | 23.77,56.08 25.3,56.08 25.38,56.01 C2.2 | 23.55,61.65 23.77,61.42 23.77,56.08 | 23.55,61.65 17.45,67.74 16.31,67.74 C8.2 16.08,67.89 16,67.97 13.84,67.97 13.63,68.08 C7.1 12.73,68.71 H-BRIDGE3.P12 | H-BRIDGE2.P12 23.24,81.69 24,81.69 24.23,81.46 24.99,81.46 C4.1 25.22,81.46 28.96,81.46 30.48,79.93 C5.2 30.56,79.7 30.56,79.55 35.97,74.14 35.97,71.55 PWMDRIVER.3 36.04,71.32 36.58,71.32 PWMDRIVER.2 36.88,71.32 37.11,71.32 PWMDRIVER.1 37.34,71.32 | 37.34,71.32 37.34,72.08 38.41,73.15 51.36,73.15 60.15,81.94 10-PINMOLEX.8 | 37.34,71.32 37.34,66.45 | v26.06,64.16 23.55,61.65 | v27.1,66.26 27.29,66.45 37.34,66.45 | 37.34,66.45 37.34,65.55 PWMDRIVER.28
  Bottom 0.457: v27.1,66.26 26.06,65.22 v26.06,64.16
5V_2  (via drill 0.35)
  Top 0.457: U$8.RAW 92.32,72.39 93.23,73.3 93.23,76.85 85.5,84.58 v75.53,84.58 10-PINMOLEX.1 | v20.27,47.55 23.07,47.55 U1.1 | 56.69,29.11 55.47,27.89 C13.1 51.26,28 U$2.1 | v56.69,31.23 56.69,29.11 | 56.69,29.11 57.91,27.89 67.51,27.89 69.04,26.36 69.04,11.58 | IC4.3 68.09,10.63 69.04,11.58 | 69.04,11.58 69.99,10.63 IC4.1
  Bottom 0.457: v75.53,84.58 75.53,78.12 73.91,76.5 62.18,76.5 56.69,71.02 56.69,64.31 | v56.69,31.23 56.69,64.31 | v20.27,47.55 18.75,47.55 17.98,48.31 17.98,49.38 18.59,49.99 30.63,49.99 41.15,60.5 52.88,60.5 56.69,64.31
+3V3  (via drill 0.35)
  Top 0.305: X2.4 49.77,46.7 50.44,46.02 v58.22,46.02 | v72.54,14.78 75.54,14.78 76.76,16
  Top 0.457: IC4.5 70.78,5.86 75.29,10.37 C12.+ 76.76,10.47 76.76,16 76.76,17.68 IC3.1
  Bottom 0.305: v58.22,46.02 72.54,31.7 v72.54,14.78
CHASSIS  (via drill 3.18)  (3 unrouted)
  Top 0.61: R67.2 8.33,5.64 v5.08,8.89 | R66.2 90.76,5.03 v90.81,5.08 | R65.2 90.81,83.88 v90.81,85.09 | R64.2 8.02,82.55 v5.08,82.55
CLK  (via drill 0.35)
  Top 0.305: U$8.D13 92.56,52.07 94.64,49.99 v94.64,33.83 94.64,10.67 93.27,9.3 82.6,9.3 79.17,12.72 IC3.3 | v87.48,33.38 87.48,28.78 85.52,26.82 IC3.9
  Bottom 0.305: v94.64,33.83 94.18,33.38 v87.48,33.38
CS
  Top 0.305: U$8.D10 90.79,13.38 90.53,13.11 85.5,13.11 84.25,14.35 IC3.7
DI
  Top 0.305: U$8.D11 92.31,46.99 92.96,46.33 92.96,12.34 91.75,11.12 83.52,11.12 81.71,12.93 IC3.5
DO  (via drill 0.35)
  Top 0.305: U$8.D12 79.7,49.53 v79.25,49.07 | v66.29,49.07 65.84,49.53 53.65,49.53 53.06,50.12 X2.7
  Bottom 0.457: v79.25,49.07 79.25,43.43 77.72,41.91 69.34,41.91 66.29,44.96 v66.29,49.07
DTR
  Top 0.457: 10-PINMOLEX.2 69.15,83.56 69.8,82.91 85.04,82.91 89.52,78.42 U$8.DTR
GND  (via drill 0.35)
  Top 0.406: H-BRIDGE2.P3 v14.57,82.97 | H-BRIDGE2.P6 16.25,81.02 v16.15,80.92 | H-BRIDGE3.P3 v4.33,70.01 | H-BRIDGE3.P6 v4.33,68.06
  Top 0.457: H-BRIDGE3.P13 v13.09,69.36 | H-BRIDGE1.P3 v12.56,58.12 | H-BRIDGE1.P13 v21.77,57.48 | v29.39,82.32 26.05,82.32 26.04,82.32 24.36,82.32 24.35,82.32 H-BRIDGE2.P13 | v12.71,54.19 12.71,55.68 13.2,56.17 H-BRIDGE1.P6
  other vias: 2.61,77.65 18.44,76.06 9.17,73.64 4.93,63.57 23.45,72.07 16.39,62.06 35.75,61.59 31.12,61.59 27.25,60.46 35.56,79.9 32.01,75.34 52.36,83.87 41.88,68.67 23.8,25.24 26.44,22.3 18.04,9.06 4.77,14.56 73.36,5.23 17.34,43.37 23.28,40.63 31.95,42.04 8.23,28.96 39.93,83.97 29.05,24.82 10.83,29.02 13.53,39.41 12.71,52.21 12.71,50.23 12.71,48.25 35.93,46.12 27.09,37.13 17.34,53.13 16.27,51.45 18.4,51.45 14.26,62.06 18.53,62.06 4.93,65.55 13.42,29.02 10.83,33.14 8.24,33.14 13.42,33.14 23.35,19.45 28.68,17.93 32.34,21.43 18.32,31.19 25.24,15.83 21.13,28.17 27.28,78.65 26.06,77.58 16.9,71.61 21.47,67.19 7.86,60.08 7.86,55.81 7.86,51.55 60.87,71.67 68.34,58.87 60.87,63.44 60.87,52.16 35.93,52.67 40.04,42.16 35.93,38.5 31.05,33.77 38.22,27.07 63.67,24.02 63.67,19.75 63.67,15.49 63.67,11.22 58.18,13.2 80.74,3.9 78.6,3.9 81.6,27.63 76.57,27.63 87.08,21.07 76.72,37.23 24.08,54.56 60.87,67.4 64.68,65.57 64.68,69.69 68.34,67.56 68.34,63.44 64.68,61.15 68.34,71.67 64.68,56.58
  pour Top (isolate 0.254): -0.93,-10.66 103.14,-10.66 103.89,-9.91 103.89,86.19 95.66,94.42 -3.17,94.42 -8.04,89.56 -8.04,-3.56
  pour Bottom (isolate 0.254): 8.1,-14.96 91.94,-14.96 110.08,3.18 110.08,86.09 98.31,97.86 -4.42,97.86 -15.94,86.34 -15.94,9.07
  pour Route2: 8.41,-21.87 92.63,-21.87 116.66,2.17 116.66,87.9 103.75,100.81 25.91,100.81 -6.39,100.66 -6.39,100.66 -6.4,100.66 -6.42,100.66 -6.42,100.66 -9.26,100.66 -24.16,85.77 -24.16,10.7
  pour Route15: 0.49,-4.19 94.46,-4.19 101.73,3.08 101.73,86.23 96.74,91.21 -3.01,91.21 -6.18,86.54 -5.41,1.71
I2C_SCL_3
  Top 0.152: PWMDRIVER.26 36.04,65.46 36.04,64.01 36.8,63.25 45.72,63.25 63.15,80.68 10-PINMOLEX.6
I2C_SDA_3
  Top 0.152: 10-PINMOLEX.7 61.65,81.08 44.88,64.31 37.03,64.31 36.65,64.69 36.65,65.46 PWMDRIVER.27
MTQ1_A  (via drill 0.35)
  Top 0.152: v33.02,73.99 33.14,73.99 33.98,73.15 33.98,71.4 PWMDRIVER.6 | v20.88,62.54 20.88,60.2 20.34,59.66 20.34,59.44 H-BRIDGE1.P16
  Bottom 0.152: v20.88,62.54 32.34,73.99 v33.02,73.99
MTQ1_B  (via drill 0.35)
  Top 0.152: v30.48,69.04 32.69,69.04 33.38,69.72 33.38,71.32 PWMDRIVER.7 | v22.48,61.49 22.48,61.34 21.26,60.12 21.26,59.05 21.03,58.83 20.34,58.83 H-BRIDGE1.P15
  Bottom 0.152: v22.48,61.49 22.48,63.05 28.46,69.04 v30.48,69.04
MTQ2_A  (via drill 0.35)
  Top 0.152: v32.38,69.65 32.69,69.95 32.69,71.32 PWMDRIVER.8 | v32.38,63.35 31.93,62.89 31.93,56.77 27.13,51.97 23.24,51.97 20.34,54.86 H-BRIDGE1.P9
  Bottom 0.152: v32.38,63.35 v32.38,69.65
MTQ2_B  (via drill 0.35)
  Top 0.152: v29.87,67.21 29.87,69.34 30.18,69.65 30.79,69.65 32.08,70.94 32.08,71.32 PWMDRIVER.9 | v29.83,63.31 29.83,57.8 25.98,53.95 23.62,53.95 23.32,53.65 22.02,53.65 21.26,54.41 21.26,55.24 21.03,55.47 20.34,55.47 H-BRIDGE1.P10
  Bottom 0.152: v29.83,63.31 29.83,67.17 v29.87,67.21
MTQ3_A  (via drill 0.35)
  Top 0.152: v28.1,80.3 28.1,76.67 31.39,73.38 31.39,71.4 PWMDRIVER.10 | v26.29,83.78 25.23,83.78 24.77,84.24 23.2,84.24 H-BRIDGE2.P16
  Bottom 0.152: v26.29,83.78 28.1,81.97 v28.1,80.3
MTQ3_B  (via drill 0.35)
  Top 0.152: v26.62,80.53 26.62,77.7 30.79,73.53 30.79,71.4 PWMDRIVER.11 | v24.46,83.59 23.24,83.59 H-BRIDGE2.P15
  Bottom 0.152: v24.46,83.59 24.46,82.69 v26.62,80.53
MTQ4_A
  Top 0.152: PWMDRIVER.12 30.1,71.4 30.1,72.62 23.24,79.48 23.24,79.7 H-BRIDGE2.P9
MTQ4_B  (via drill 0.35)
  Top 0.152: v24.16,77.65 29.49,72.31 29.49,71.4 PWMDRIVER.13 | v25.07,78.56 24.77,78.56 24.16,79.17 24.16,80.09 23.93,80.31 23.24,80.31 H-BRIDGE2.P10
  Bottom 0.152: v25.07,78.56 v24.16,77.65
MTQ5_A
  Top 0.152: PWMDRIVER.15 28.8,65.53 24.16,65.53 16.08,73.61 13.95,73.61 11.69,71.35 H-BRIDGE3.P16
MTQ5_B
  Top 0.152: PWMDRIVER.16 29.49,65.46 29.49,65.15 29.11,64.77 22.78,64.77 14.86,72.69 13.56,72.69 12.42,71.55 12.42,70.94 12.19,70.71 11.51,70.71 H-BRIDGE3.P15
N$1
  Top 0.305: H-BRIDGE2.P2 17.3,83.59 15.77,83.59 15.39,83.97 15.39,84.58 16.23,85.42 48.16,85.42 52.58,81 52.58,78.64 51.61,77.67 JP3.2 49.45,77.57 39.78,77.57 MTQ3.2
N$2
  Top 0.152: C3.2 22.78,60.2 22.78,59.97 20.95,58.14 20.34,58.14 H-BRIDGE1.P14
N$3
  Top 0.305: H-BRIDGE1.P4 14.4,57.45 12.42,57.45 11.28,56.31 11.28,44.81 17.98,38.1 17.98,36.42 16.15,34.59 JP1.1 16.15,34.75 11.66,39.24 11.66,41.45 MTQ1.1
N$4
  Top 0.305: H-BRIDGE1.P2 14.4,58.75 11.96,58.75 10.59,57.38 10.59,43.74 MTQ1.2 11.81,42.75 12.04,42.75 16.15,38.63 JP1.2
N$5
  Top 0.305: JP2.1 43.79,20.78 MTQ2.1 39.37,20.27 13.41,46.23 13.41,55.16 13.77,55.52 H-BRIDGE1.P7
N$6
  Top 0.305: JP2.2 43.82,18.24 43.16,18.9 MTQ2.2 38.74,19.02 12,45.76 12,56.41 12.42,56.83 H-BRIDGE1.P5
N$7
  Top 0.152: C1.2 22.63,54.48 20.95,56.16 20.34,56.16 H-BRIDGE1.P11
N$8  (via drill 0.35)
  Top 0.305: v11.34,72.78 11.34,75.12 16.54,80.31 17.3,80.31 H-BRIDGE2.P7 | v11.37,65.07 10.61,64.31 7.56,64.31 5.11,61.86 5.11,29.79 7.47,27.43 14.17,27.43 20.27,21.34 20.27,10.06 23.32,7.01 32.61,7.01 36.12,3.5 55.78,3.5 57.76,5.49 57.76,7.16 56.24,8.69 48.67,8.69 MTQ4.1 48.01,8.03 JP4.1
  Bottom 0.305: v11.37,65.07 11.37,72.75 v11.34,72.78
N$9
  Top 0.305: H-BRIDGE2.P5 17.3,81.61 10.52,81.61 7.46,78.55 7.46,76.74 6.07,75.35 4.26,75.35 1.37,72.47 1.37,21.64 17.37,5.64 32.31,5.64 35.51,2.44 56.39,2.44 58.83,4.88 58.83,7.62 56.56,9.89 MTQ4.2 47.94,10.57 JP4.2
N$10
  Top 0.152: C6.2 26.81,82.98 23.24,82.98 H-BRIDGE2.P14
N$11
  Top 0.152: C4.2 24.99,79.7 24.99,79.86 23.85,81 23.24,81 H-BRIDGE2.P11
N$12  (via drill 0.35)
  Top 0.305: v16.08,82.3 17.3,82.3 H-BRIDGE2.P4 | v25.15,84.73 25.6,84.73 25.83,84.96 33.6,84.96 MTQ3.1 41.15,80.16 49.53,80.16 JP3.1
  Bottom 0.305: v16.08,82.3 22.17,82.3 24.61,84.73 v25.15,84.73
N$13
  Top 0.305: H-BRIDGE3.P2 5.56,70.64 3.58,70.64 2.44,69.49 2.44,22.33 13.72,11.05 15.7,11.05 18.9,14.25 18.9,16.92 18.09,17.73 JP5.2 15.93,17.83 15.93,22.17 14.94,23.16 11.43,23.16 MTQ5.2
N$16
  Top 0.152: C9.2 14.17,71.86 13.95,71.86 12.12,70.03 11.51,70.03 H-BRIDGE3.P14
N$17
  Top 0.152: C7.2 13.34,66.37 13.34,66.67 12.42,67.59 12.42,67.74 12.12,68.05 11.51,68.05 H-BRIDGE3.P11
N$18
  Top 0.305: H-BRIDGE3.P4 5.56,69.34 4.19,69.34 3.5,68.66 3.5,24.28 5.84,21.95 MTQ5.1 11.51,21.87 11.51,16.54 12.85,15.19 JP5.1
N$22
  Top 0.305: IC3.10 84.3,24 84.3,32.81 ACT1.A
N$23  (via drill 0.35)
  Top 0.305: X2.5 50.87,47.88 51.51,47.24 v58.22,47.24 | v77.88,14.78 77.88,17.78 IC3.2
  Bottom 0.305: v58.22,47.24 73.76,31.7 73.76,12.95 74.68,12.04 77.42,12.04 77.88,12.5 v77.88,14.78
N$24  (via drill 0.35)
  Top 0.305: IC3.6 82.98,14.86 83.06,14.78 v82.98,14.71 | X2.2 47.57,44.63 48.92,43.28 v58.22,43.28 | 74.98,30.18 65.99,30.18 65.08,31.09 v65.08,35.36 | 74.98,30.18 v77.88,30.18 | 74.98,30.18 75.96,31.16 R2.1
  Bottom 0.305: v82.98,14.71 83.06,14.78 88.24,14.78 89,15.54 89,29.26 88.09,30.18 v77.88,30.18 | v58.22,43.28 65.08,36.42 v65.08,35.36
N$25
  Top 0.305: ACT1.C R2.2
N$26  (via drill 0.35)
  Top 0.305: X2.3 48.67,45.51 49.53,44.65 v58.22,44.65 | v80.47,14.78 80.47,17.78 IC3.4
  Bottom 0.305: v58.22,44.65 71.02,31.85 71.02,11.73 72.08,10.67 79.7,10.67 80.47,11.43 v80.47,14.78
RES
  Top 0.305: U$8.D7 70.41,49.53 60.66,39.78 44.35,39.78 41.09,36.52 U$2.5
RST  (via drill 0.35)
  Top 0.305: U$8.RST 88.45,67.31 87.78,67.97 87.78,70.1 86.87,71.02 v79.55,71.02 | v64.62,74.98 64.62,84.55
  Top 0.457: 64.62,84.55 10-PINMOLEX.5
  Bottom 0.305: v79.55,71.02 65.68,71.02 64.62,72.08 v64.62,74.98
RX  (via drill 0.35)
  Top 0.305: U$8.D9 70.51,44.45 63.09,37.03 v52.88,37.03 | v46.94,37.03 46.17,36.27 U$2.3
  Bottom 0.457: v52.88,37.03 v46.94,37.03
RXI
  Top 0.305: U$8.RX1-1 84.44,76.64 83.52,77.57 71.63,77.57 66.15,83.05 10-PINMOLEX.4
TX
  Top 0.305: U$8.D8 70.46,46.99 61.87,38.41 50.9,38.41 48.72,36.22 U$2.2
TXO
  Top 0.305: U$8.TX0-1 86.98,79.13 84.58,81.53 69.34,81.53 67.65,83.23 10-PINMOLEX.3
VCC  (via drill 0.35)
  Top 0.152: 17.3,84.28 H-BRIDGE2.P1
  Top 0.406: v13.18,59.44 14.46,59.44 H-BRIDGE1.P1 | H-BRIDGE3.P1 5.63,71.78 6.07,72.21 v6.4,72.21
  Top 0.457: v16.08,84.28 17.3,84.28 | U1.3 19,43.12 v14.58,47.54
  Bottom 0.152: 13.18,58.64 13.19,58.63
  Bottom 0.457: v16.08,84.28 16.08,83.21 6.4,73.53 v6.4,72.21 6.4,66.22 v13.18,59.44 13.18,58.64 | 13.19,58.63 13.19,54.87 14.58,53.48 v14.58,47.54
(copper drawn outside any net)
  shapes: Top area x1

### Text on the board
tPlace: 5V ready Micro-SD | Breakout board+